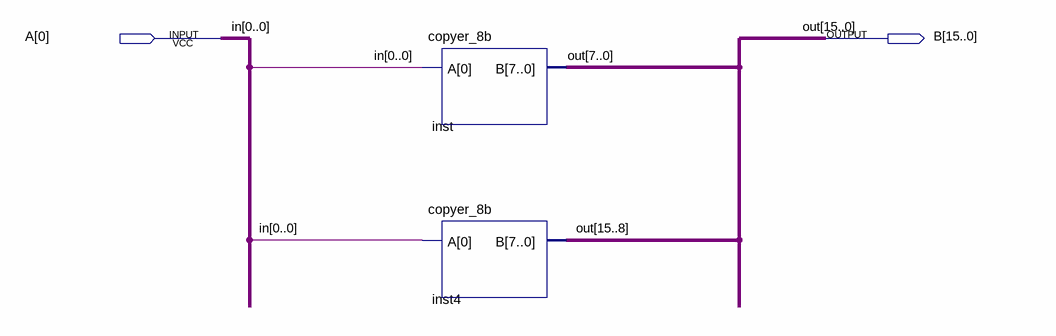
[diagram p0: schematic sheet]
// Quartus schematic copyer_16b.bdf as structural Verilog: 2 symbols, 2 pins
module copyer_16b (
  input  [0:0] A,
  output [15:0] B
);

  copyer_8b inst (.A(A[0]), .B(B[7:0]));
  copyer_8b inst4 (.A(A[0]), .B(B[15:8]));

  // Other names for the same wires on the sheet: in[0] = A[0]; out[15:0] = B
endmodule
